# Altium schematic sheet Connectors.SchDoc
size Letter; SheetNumber: 2; SheetTotal: 8
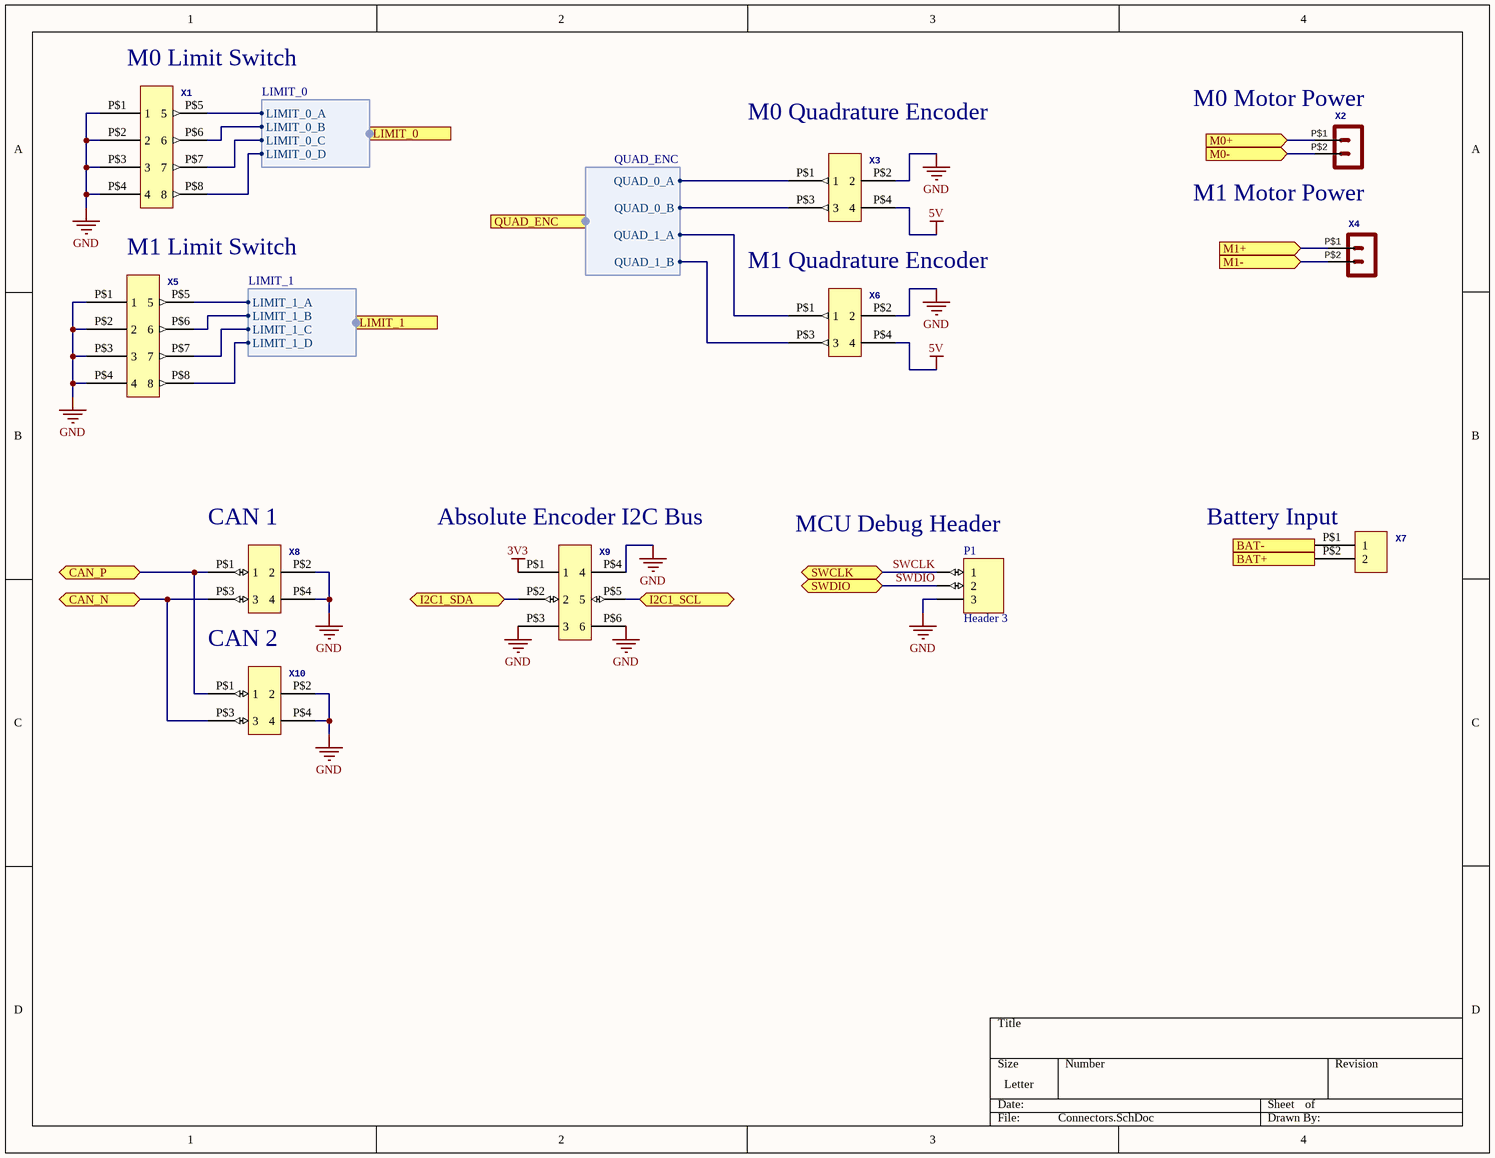
[diagram p0: Connectors.SchDoc]

## Parts
P1  Header 3  [HDR1X3]
X1  Molex 43045-0812  [43045-0812]  (value not drawn)
X2  Molex - Micro-Fit 3.0 Series connector,  3.00mm (0.118") pitch header, 2 positions.  [43045-0212]  (value not drawn)
X3  Molex 43045-0412  [43045-0412]  (value not drawn)
X4  Molex - Micro-Fit 3.0 Series connector,  3.00mm (0.118") pitch header, 2 positions.  [43045-0212]  (value not drawn)
X5  Molex 43045-0812  [43045-0812]  (value not drawn)
X6  Molex 43045-0412  [43045-0412]  (value not drawn)
X7  Molex 43650-0215  [43650-0215]  (value not drawn)
X8  Molex 43045-0412  [43045-0412]  (value not drawn)
X9  Molex 43045-0612  [43045-0612]  (value not drawn)
X10  Molex 43045-0412  [43045-0412]  (value not drawn)

## Ports
BAT+, BAT-, CAN_N (bidir), CAN_P (bidir), I2C1_SCL (bidir), I2C1_SDA (bidir), LIMIT_0 (harness LIMIT_0), LIMIT_1 (harness LIMIT_1), M0+ (in), M0- (in), M1+ (in), M1- (in), QUAD_ENC (harness QUAD_ENC), SWCLK (bidir), SWDIO (bidir)

## Harnesses
LIMIT_0: LIMIT_0_A, LIMIT_0_B, LIMIT_0_C, LIMIT_0_D
LIMIT_1: LIMIT_1_A, LIMIT_1_B, LIMIT_1_C, LIMIT_1_D
QUAD_ENC: QUAD_0_A, QUAD_1_A, QUAD_1_B, QUAD_0_B

## Nets
3V3: X9.P$1(1)
5V: X3.P$4(4) X6.P$4(4)
GND: P1.3 X1.P$1(1) X1.P$2(2) X1.P$3(3) X1.P$4(4) X3.P$2(2) X5.P$1(1) X5.P$2(2) X5.P$3(3) X5.P$4(4) X6.P$2(2) X8.P$2(2) X8.P$4(4) X9.P$3(3) X9.P$4(4) X9.P$6(6) X10.P$2(2) X10.P$4(4)
BAT+: X7.P$2(2) ; port BAT+
BAT-: X7.P$1(1) ; port BAT-
CAN_N: X8.P$3(3) X10.P$3(3) ; port CAN_N
CAN_P: X8.P$1(1) X10.P$1(1) ; port CAN_P
I2C1_SCL: X9.P$5(5) ; port I2C1_SCL
I2C1_SDA: X9.P$2(2) ; port I2C1_SDA
M0+: X2.P$1 ; port M0+
M0-: X2.P$2 ; port M0-
M1+: X4.P$1 ; port M1+
M1-: X4.P$2 ; port M1-
SWCLK: P1.1 ; port SWCLK
SWDIO: P1.2 ; port SWDIO
NetX1_P$5: X1.P$5(5) ; port LIMIT_0.LIMIT_0_A
NetX1_P$6: X1.P$6(6) ; port LIMIT_0.LIMIT_0_B
NetX1_P$7: X1.P$7(7) ; port LIMIT_0.LIMIT_0_C
NetX1_P$8: X1.P$8(8) ; port LIMIT_0.LIMIT_0_D
NetX3_P$1: X3.P$1(1) ; port QUAD_ENC.QUAD_0_A
NetX3_P$3: X3.P$3(3) ; port QUAD_ENC.QUAD_0_B
NetX5_P$5: X5.P$5(5) ; port LIMIT_1.LIMIT_1_A
NetX5_P$6: X5.P$6(6) ; port LIMIT_1.LIMIT_1_B
NetX5_P$7: X5.P$7(7) ; port LIMIT_1.LIMIT_1_C
NetX5_P$8: X5.P$8(8) ; port LIMIT_1.LIMIT_1_D
NetX6_P$1: X6.P$1(1) ; port QUAD_ENC.QUAD_1_A
NetX6_P$3: X6.P$3(3) ; port QUAD_ENC.QUAD_1_B

## Notes on the sheet
- (near X1) M0 Limit Switch
- M0 Quadrature Encoder
- (near X2) M0 Motor Power
- M1 Motor Power
- M1 Limit Switch
- M1 Quadrature Encoder
- (near X8) CAN 1
- (near X9) Absolute Encoder I2C Bus
- (near P1) MCU Debug Header
- (near X7) Battery Input
- CAN 2

## Library data of the parts
P1 = Header 3: Header, 3-Pin; LatestRevisionDate: 17-Jul-2002; LatestRevisionNote: Re-released for DXP Platform.; Publisher: Altium Limited
X1 X5 = Micro-Fit Molex 8 Pin 2 Row Vertical: GateName_1: G$1; SymbolName_1: HEADER_POS8; DeviceSetName: HEADER_POS8_?; DeviceName: 43045-0812; LibraryName: con-molex-micro-fit-3_0_2; Package: 43045-0812
X2 X4 = HEADER_POS2_?43045-0212: GateName_1: G$1; SymbolName_1: HEADER_POS2; DeviceName: 43045-0212; LibraryName: con-molex-micro-fit-3_0_2; DeviceSetName: HEADER_POS2_?; Package: 43045-0212
X3 X6 X8 X10 = Micro-Fit Molex 4 Pin 2 Row Vertical: GateName_1: G$1; SymbolName_1: HEADER_POS4; DeviceSetName: HEADER_POS4_?; DeviceName: 43045-0412; LibraryName: con-molex-micro-fit-3_0_2; Package: 43045-0412
X7 = Micro-Fit Molex 2 Pin Vertical: SymbolName_1: HEADER_POS2; DeviceSetName: HEADER_POS2_?; GateName_1: G$1; Package: 43650-0215; DeviceName: 43650-0215; LibraryName: con-molex-micro-fit-3_0_2
X9 = Micro-Fit Molex 6 Pin 2 Row Vertical: GateName_1: G$1; SymbolName_1: HEADER_POS6; DeviceSetName: HEADER_POS6_?; DeviceName: 43045-0612; LibraryName: con-molex-micro-fit-3_0_2; Package: 43045-0612